# Altium schematic sheet main.SchDoc
size A
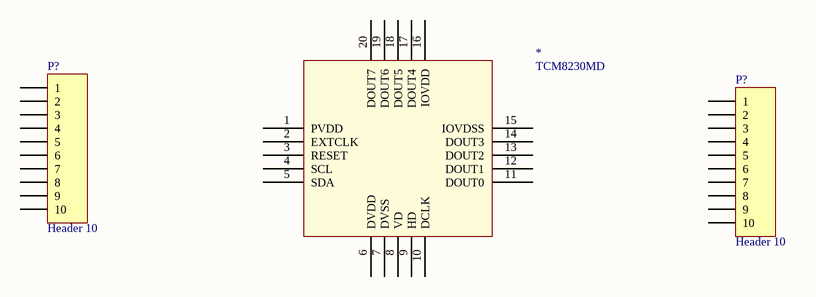
[diagram p0: main.SchDoc]

## Parts
(Parts that share a designator on the sheet are numbered #1, #2 ... from top to bottom, then left to right.)
*  TCM8230MD
P?#1  Header 10  [HDR1X10]
P?#2  Header 10  [HDR1X10]

## Nets

Not connected (* = marked no-connect by the designer): * 1(PVDD) 2(EXTCLK) 3(RESET) 4(SCL) 5(SDA) 6(DVDD) 7(DVSS) 8(VD) 9(HD) 10(DCLK) 11(DOUT0) 12(DOUT1) 13(DOUT2) 14(DOUT3) 15(IOVDSS) 16(IOVDD) 17(DOUT4) 18(DOUT5) 19(DOUT6) 20(DOUT7); P?#1 1 2 3 4 5 6 7 8 9 10; P?#2 1 2 3 4 5 6 7 8 9 10

## Library data of the parts
P?#1 P?#2 = Header 10: Header, 10-Pin; LatestRevisionDate: 17-Jul-2002; LatestRevisionNote: Re-released for DXP Platform.; Publisher: Altium Limited